# Altium schematic sheet PW1555.SchDoc
size A4; SheetNumber: 1; SheetTotal: 1
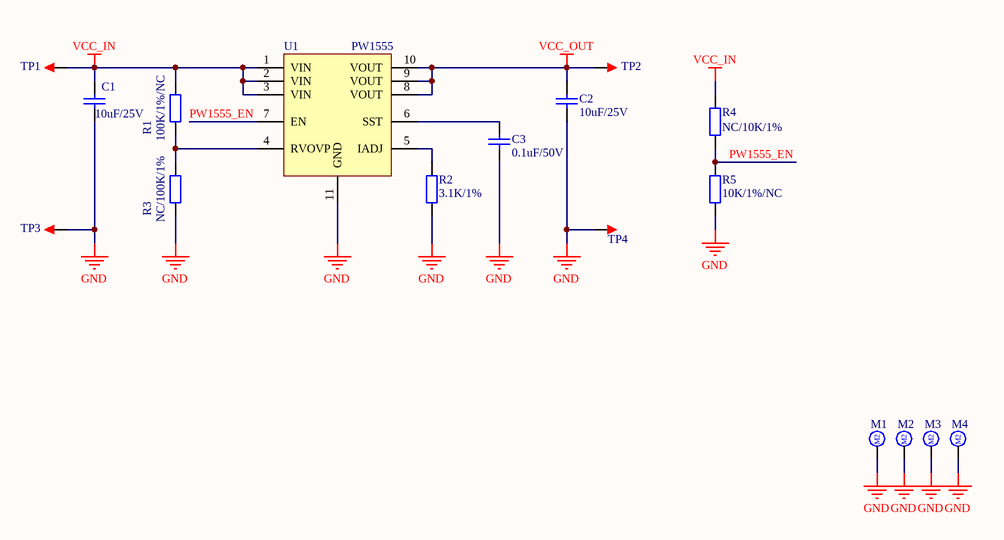
[diagram p0: PW1555.SchDoc]

## Parts
C1  10uF/25V  [C0805_L]
C2  10uF/25V  [C0805_L]
C3  0.1uF/50V  [C0402_L]
M1  M2  [M2焊盘]  (value not drawn)
M2  M2  [M2焊盘]  (value not drawn)
M3  M2  [M2焊盘]  (value not drawn)
M4  M2  [M2焊盘]  (value not drawn)
R1  100K/1%/NC  [R0402_L]
R2  3.1K/1%  [R0402_L]
R3  NC/100K/1%  [R0402_L]
R4  NC/10K/1%  [R0402_L]
R5  10K/1%/NC  [R0402_L]
TP1  TEST  [PAD_5x5]  (value not drawn)
TP2  TEST  [PAD_5x5]  (value not drawn)
TP3  TEST  [PAD_5x5]  (value not drawn)
TP4  TEST  [PAD_5x5]  (value not drawn)
U1  PW1555  [DFN3x3-10]

## Nets
GND: C1.1 C2.1 C3.1 M1.1 M2.1 M3.1 M4.1 R2.1 R3.1 R5.1 TP3.1 TP4.1 U1.11(GND)
VCC_IN: C1.2 R1.2 R4.2 TP1.1 U1.1(VIN) U1.2(VIN) U1.3(VIN)
VCC_OUT: C2.2 TP2.1 U1.8(VOUT) U1.9(VOUT) U1.10(VOUT)
PW1555_EN: R4.1 R5.2 U1.7(EN)
NetC3_2: C3.2 U1.6(SST)
NetR1_1: R1.1 R3.2 U1.4(RVOVP)
NetR2_2: R2.2 U1.5(IADJ)

## Library data of the parts
C1-C3 = C: 贴片电容; BOM名称: 无极性贴片电容; 联系卖家，免费查找封装: 唯一出售店铺网址https://shop463601444.taobao.com
M1-M4 = M2系列: M2孔支撑柱
R1-R5 = R: 贴片电阻; 联系卖家，免费查找封装: 唯一出售店铺网址https://shop463601444.taobao.com; BOM名称: 贴片电阻
TP1-TP4 = TEST: 测试点; 联系卖家，免费查找封装: 唯一出售店铺网址https://shop463601444.taobao.com; 封装库来自淘宝卖家ID：黄晶宝石: 其他店铺购入均为盗版假冒封装库，请立即申请退款; BOM名称: 测试点
U1 = PW1555: VOVP  ILIM保护芯片